# EasyEDA schematic SCH_WL-134A-Carrier-Board_2025-03-29.json
TITLE: OPEN TAG READER WL-134A CARRIER; REV: 1.0; Date: 2024-06-19; Sheet: 1/1; Drawn By: Chris Chad
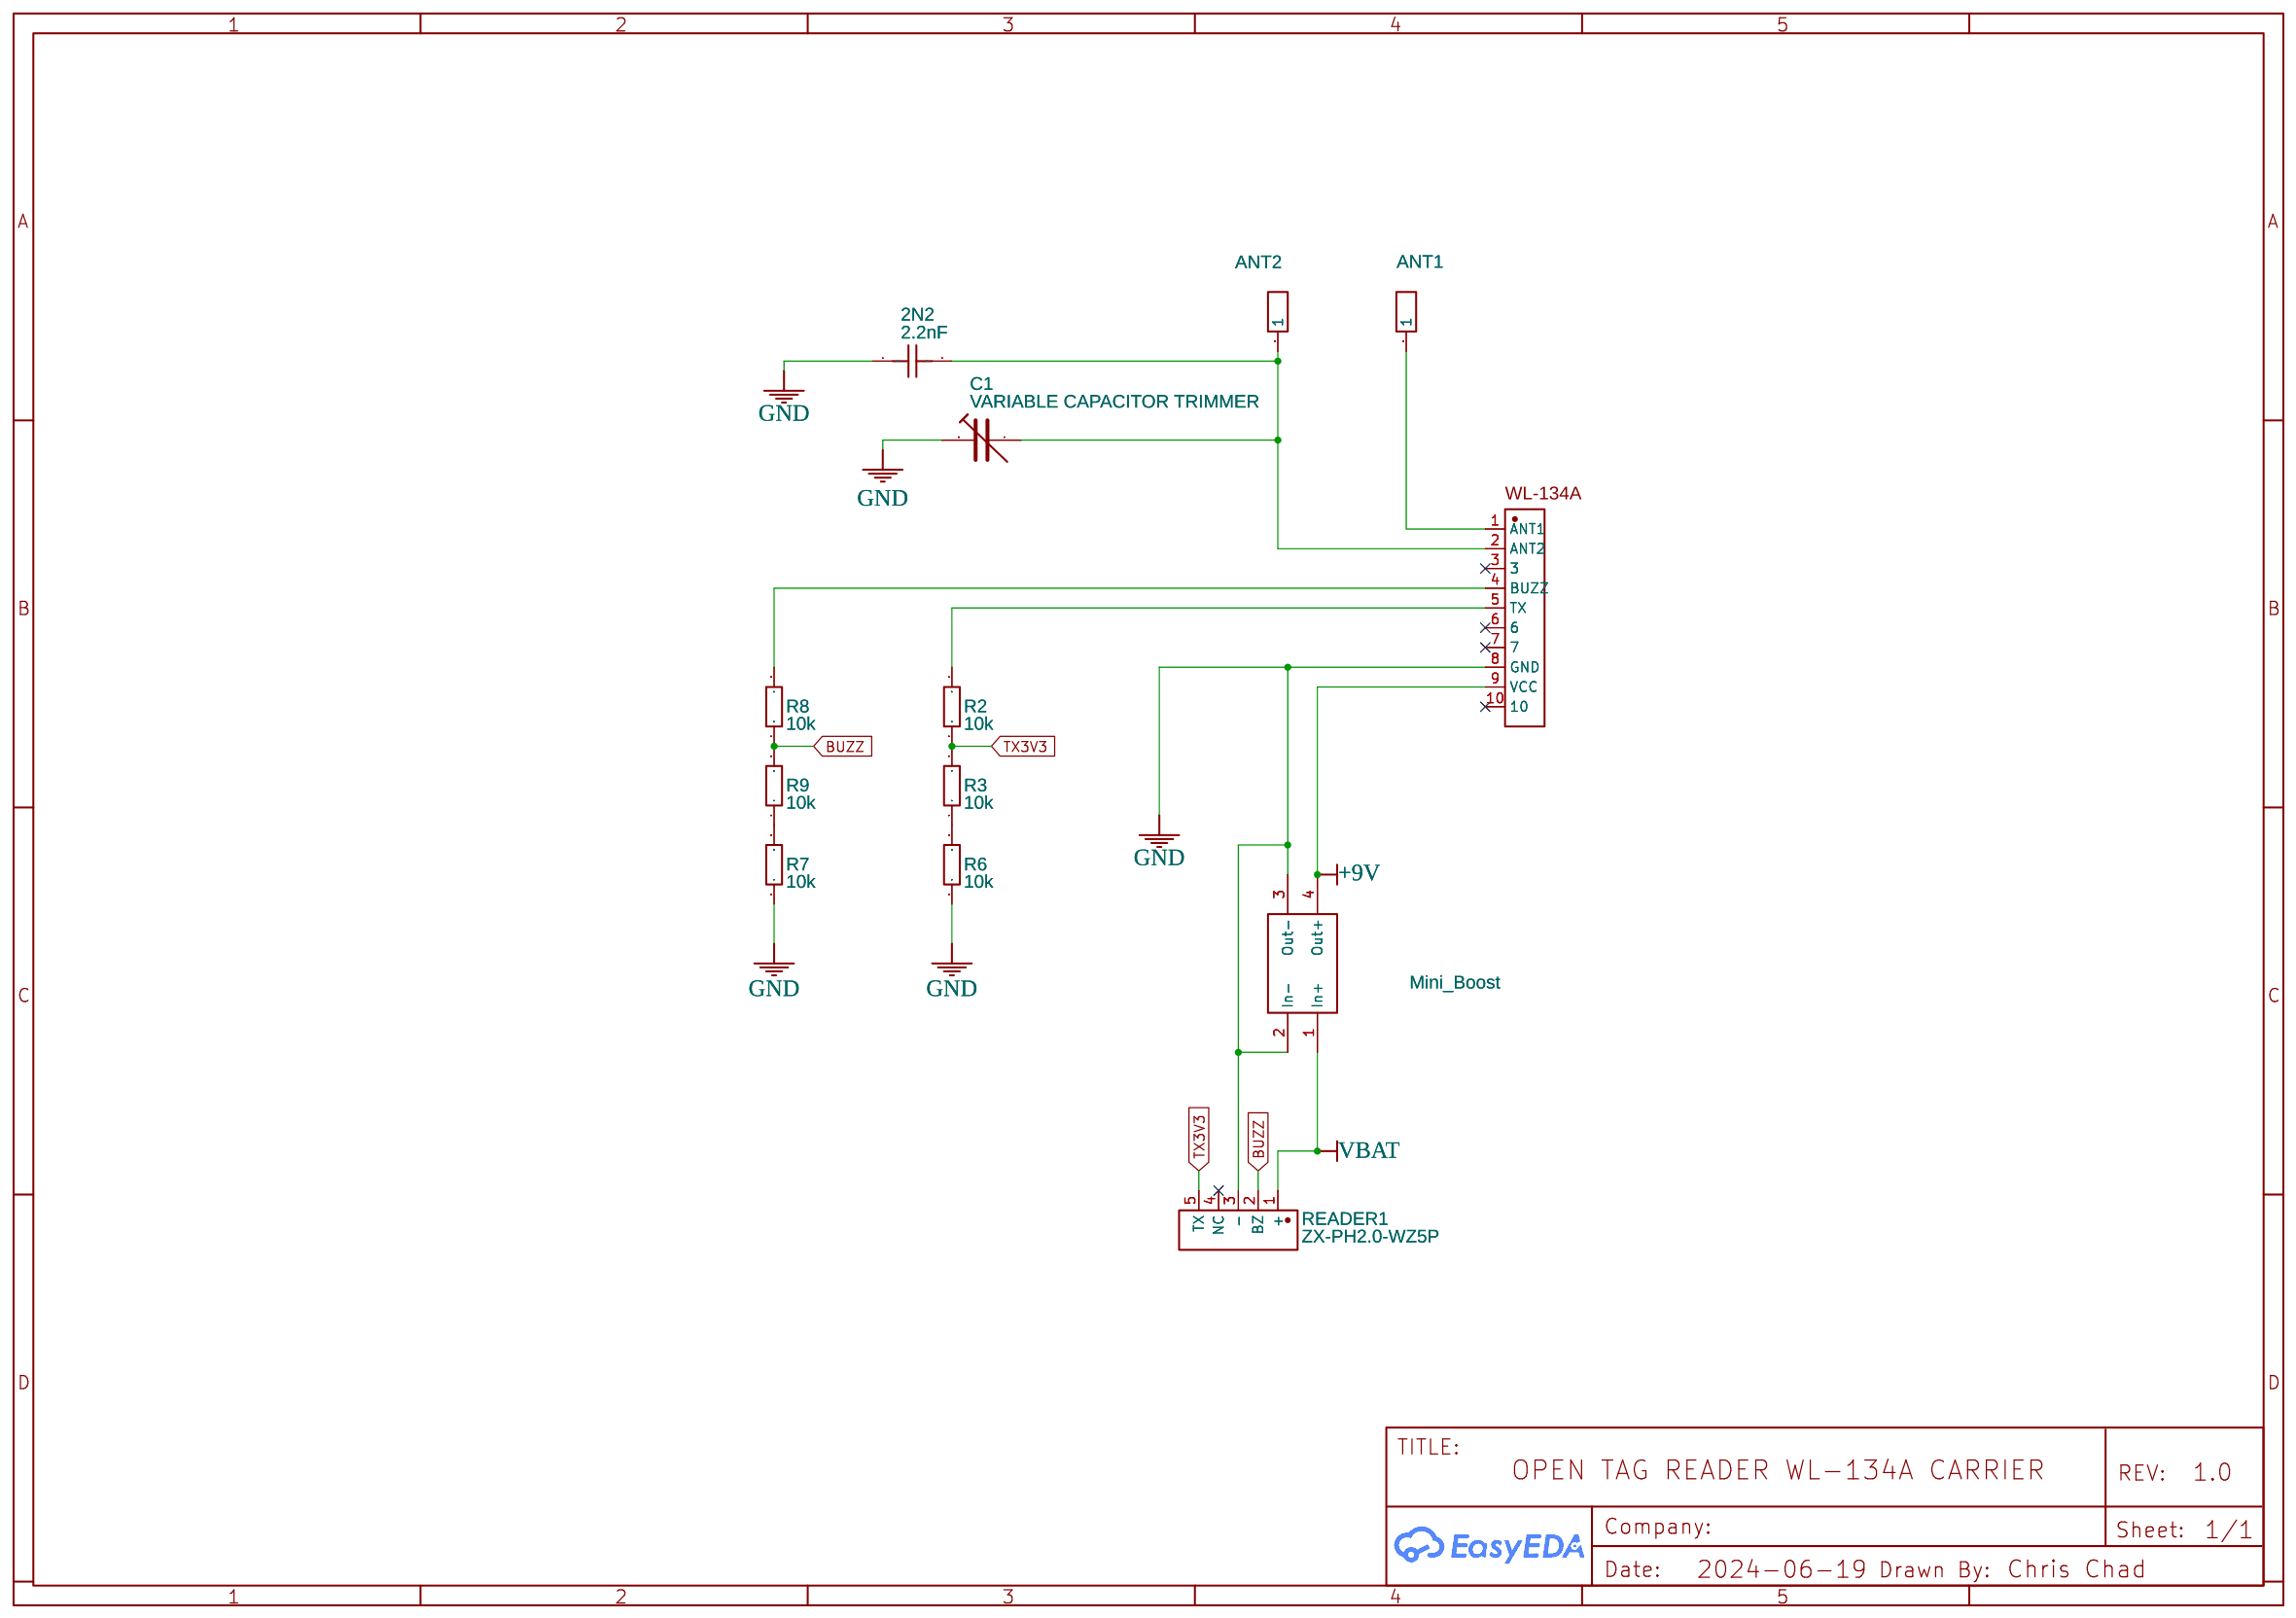
[diagram p0: schematic sheet]

## Parts
2N2  2.2nF  [CAP-TH_L7.3-W2.5-P5.00-D0.5]
ANT1  HDR-M-2.54_1x1  [HDR-M-2.54_1X1]
ANT2  HDR-M-2.54_1x1  [HDR-M-2.54_1X1]
C1  VARIABLE CAPACITOR TRIMMER  [CAPACITOR VARIABLE TRIMMER]
R2  10k  [R0805]
R3  10k  [R0805]
R6  10k  [R0805]
R7  10k  [R0805]
R8  10k  [R0805]
R9  10k  [R0805]
READER1  ZX-PH2.0-WZ5P  [CONN-TH_5P-P2.00_ZX-PH2.0-WZ5P]
U1  WL-134A  [WL-134A]
U2  Mini_Boost  [MINI_BOOST]

## Library data of the parts
2N2 = B32529C8222J189: Contributor: lcsc; Supplier: LCSC; Supplier Part: C3768236; Manufacturer: TDK
ANT1 ANT2 = HDR-M-2.54_1x1: Supplier Part: C81276; Supplier: LCSC; Contributor: LCEDA_Lib
C1 = VARIABLE CAPACITOR TRIMMER: Contributor: Kitchen War; license: https://www.gnu.org/licenses/lgpl-2.1.html
R2 R8 = RT0805DRD07510RL: Contributor: LCSC; Supplier: LCSC; Supplier Part: C327036; Manufacturer: YAGEO(国巨); JLCPCB Part Class: Extended Part
R3 R6 R7 R9 = RC0805DR-071KL: Contributor: LCSC; Supplier: LCSC; Manufacturer: YAGEO(国巨); Supplier Part: C100051; JLCPCB Part Class: Extended Part
READER1 = ZX-PH2.0-WZ5P: Contributor: lcsc; Supplier: LCSC; Supplier Part: C7429554; Manufacturer: Megastar(兆星); JLCPCB Part Class: Extended Part
U1 = WL-134A: Contributor: Chris Chad
U2 = Mini_Boost: Contributor: Chris Chad

## Nets
+9V: U1.9(VCC) U2.4(Out+)
GND: 2N2.1 C1.2 R6.1 R7.1 READER1.3(-) U1.8(GND) U2.2(In-) U2.3(Out-)
VBAT: READER1.1(+) U2.1(In+)
BUZZ: R8.1 R9.2 READER1.2(BZ)
TX3V3: R2.1 R3.2 READER1.5(TX)
Net-(2N2-2): 2N2.2 ANT2.1 C1.1 U1.2(ANT2)
Net-(ANT1-1): ANT1.1 U1.1(ANT1)
Net-(R2-2): R2.2 U1.5(TX)
Net-(R3-1): R3.1 R6.2
Net-(R7-2): R7.2 R9.1
Net-(R8-2): R8.2 U1.4(BUZZ)

Not connected (* = marked no-connect by the designer): READER1 4(NC)*; U1 3* 6* 7* 10*
